# Altium schematic sheet CubeNode.SchDoc
size A4; SheetNumber: 2; SheetTotal: 6
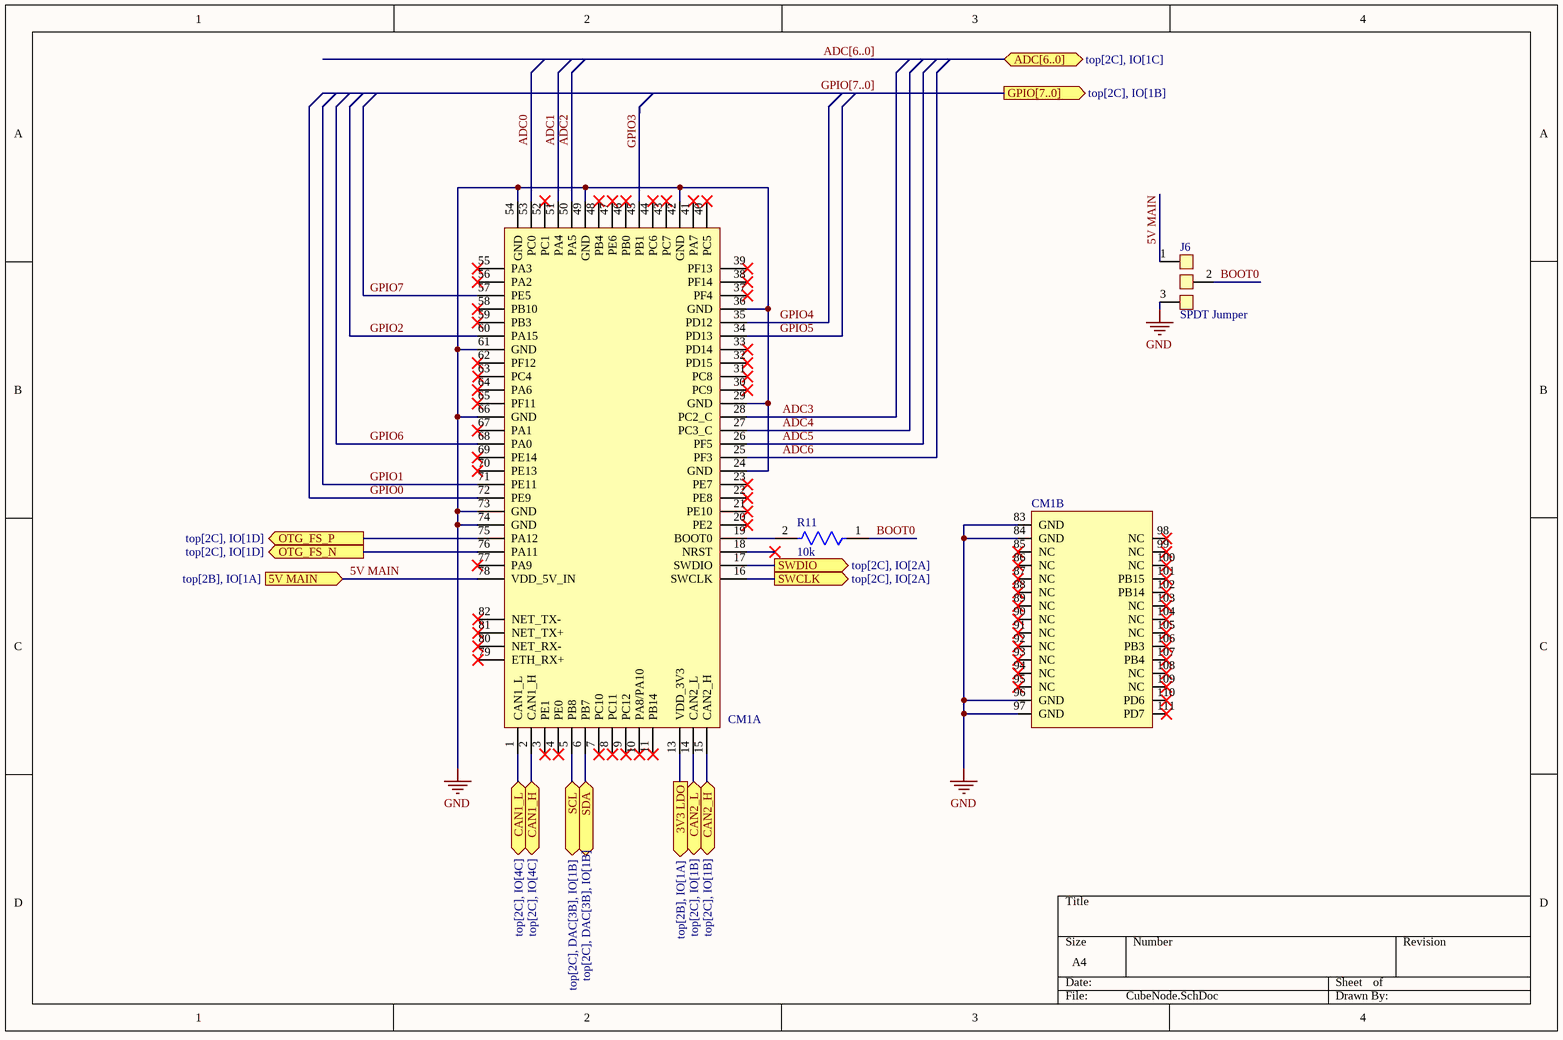
[diagram p0: CubeNode.SchDoc]

## Parts
CM1  CUBENODE_FOOTPRINT  [CubeNode]  (value not drawn)  (parts A,B of 2)  (no BOM)
J6  SPDT Jumper  [SPDT Jumper]
R11  10k  [FP-AF0603-MFG]

## Ports
3V3 LDO (out, see top[2B], IO[1A]), 5V MAIN (in, see top[2B], IO[1A]), ADC[6..0] (bidir, see top[2C], IO[1C]), CAN1_H (bidir, see top[2C], IO[4C]), CAN1_L (bidir, see top[2C], IO[4C]), CAN2_H (bidir, see top[2C], IO[1B]), CAN2_L (bidir, see top[2C], IO[1B]), GPIO[7..0] (out, see top[2C], IO[1B]), OTG_FS_N (out, see top[2C], IO[1D]), OTG_FS_P (out, see top[2C], IO[1D]), SCL (bidir, see top[2C], DAC[3B], IO[1B]), SDA (bidir, see top[2C], DAC[3B], IO[1B]), SWCLK (out, see top[2C], IO[2A]), SWDIO (out, see top[2C], IO[2A])

## Nets
GND: CM1.24(GND) CM1.29(GND) CM1.36(GND) CM1.42(GND) CM1.49(GND) CM1.54(GND) CM1.61(GND) CM1.66(GND) CM1.73(GND) CM1.74(GND) CM1.83(GND) CM1.84(GND) CM1.96(GND) CM1.97(GND) J6.3
3V3 LDO: CM1.13(VDD_3V3) ; port 3V3 LDO
5V MAIN: CM1.78(VDD_5V_IN) J6.1 ; port 5V MAIN
ADC0: CM1.53(PC0)
ADC1: CM1.51(PA4)
ADC2: CM1.50(PA5)
ADC3: CM1.28(PC2_C)
ADC4: CM1.27(PC3_C)
ADC5: CM1.26(PF5)
ADC6: CM1.25(PF3)
BOOT0: J6.2 R11.1
CAN1_H: CM1.2(CAN1_H) ; port CAN1_H
CAN1_L: CM1.1(CAN1_L) ; port CAN1_L
CAN2_H: CM1.15(CAN2_H) ; port CAN2_H
CAN2_L: CM1.14(CAN2_L) ; port CAN2_L
GPIO0: CM1.72(PE9)
GPIO1: CM1.71(PE11)
GPIO2: CM1.60(PA15)
GPIO3: CM1.45(PB1)
GPIO4: CM1.35(PD12)
GPIO5: CM1.34(PD13)
GPIO6: CM1.68(PA0)
GPIO7: CM1.57(PE5)
OTG_FS_N: CM1.76(PA11) ; port OTG_FS_N
OTG_FS_P: CM1.75(PA12) ; port OTG_FS_P
SCL: CM1.5(PB8) ; port SCL
SDA: CM1.6(PB7) ; port SDA
SWCLK: CM1.16(SWCLK) ; port SWCLK
SWDIO: CM1.17(SWDIO) ; port SWDIO
NetCM1_19: CM1.19(BOOT0) R11.2

Not connected (* = marked no-connect by the designer): CM1 3(PE1)* 4(PE0)* 7(PC10)* 8(PC11)* 9(PC12)* 10(PA8/PA10)* 11(PB14)* 18(NRST)* 20(PE2)* 21(PE10)* 22(PE8)* 23(PE7)* 30(PC9)* 31(PC8)* 32(PD15)* 33(PD14)* 37(PF4)* 38(PF14)* 39(PF13)* 40(PC5)* 41(PA7)* 43(PC7)* 44(PC6)* 46(PB0)* 47(PE6)* 48(PB4)* 52(PC1)* 55(PA3)* 56(PA2)* 58(PB10)* 59(PB3)* 62(PF12)* 63(PC4)* 64(PA6)* 65(PF11)* 67(PA1)* 69(PE14)* 70(PE13)* 77(PA9)* 79(ETH_RX+)* 80(NET_RX-)* 81(NET_TX+)* 82(NET_TX-)* 85(NC)* 86(NC)* 87(NC)* 88(NC)* 89(NC)* 90(NC)* 91(NC)* 92(NC)* 93(NC)* 94(NC)* 95(NC)* 98(NC)* 99(NC)* 100(NC)* 101(PB15)* 102(PB14)* 103(NC)* 104(NC)* 105(NC)* 106(PB3)* 107(PB4)* 108(NC)* 109(NC)* 110(PD6)* 111(PD7)*

## Buses and harness runs
bus ADC[6..0] = port ADC[6..0]
bus GPIO[7..0] = port GPIO[7..0]

## Library data of the parts
CM1 = CubeNode Footprint
R11 = CMP-03412-049106-1: Anti-Sulfurated Chip Resistors Automotive Grade 10kΩ 1% 100ppm/°C 0603